# Altium project HPBIController.PrjPCB (part 7 of 8)

## Sheet QSPIFlash.SchDoc: 02290_Sonoma_Controller
size B; ApprovedBy: J Johnson; CheckedBy: J Johnson; Author: sdfasdfdfAEFfasdFfaF; DrawnBy: J Johnson; Organization: Opsero Electronic Design; Address1: 21-915 Av. Marguerite-Bourgeoys; Address2: Québec (QC); Address3: G1S 3X4; DocumentNumber: OP009-001-SCH; Revision: D-1; SheetNumber: 06; SheetTotal: 16; Tel1: (581) 308-8830; Tel2: (581) 308-8830; Project: 02290_Sonoma_Controller; CheckedDate: 2013-12-13; Sheet: QSPI Flash; PageSetup: Record=PageOptions|CenterHorizontal=True|CenterVertical=True|PrintScale=1.08|XCorrection=1.00|YCorrection=1.00|PrintKind=0|BorderSize=5000000|LeftOffset=0|BottomOffset=0|Orientation=2|PaperLength=1000|PaperWidth=1000|Scale=100|PaperSource=7|PrintQuality=-4|MediaType=1|DitherType=10|PaperKind=Tabloid     [11 x 17 in]|PrintScaleMode=1; DrawDate: 2013-12-13; SchTitle: 02290_Sonoma_Controller; RevDescription: Replaced Q2,Q3 with STD16NF06LT4; RevDate: 2020-07-07; RevBy: J Johnson; RevDescription2: Added resistors to QSPI interface; ModifiedDate: 2020-07-07
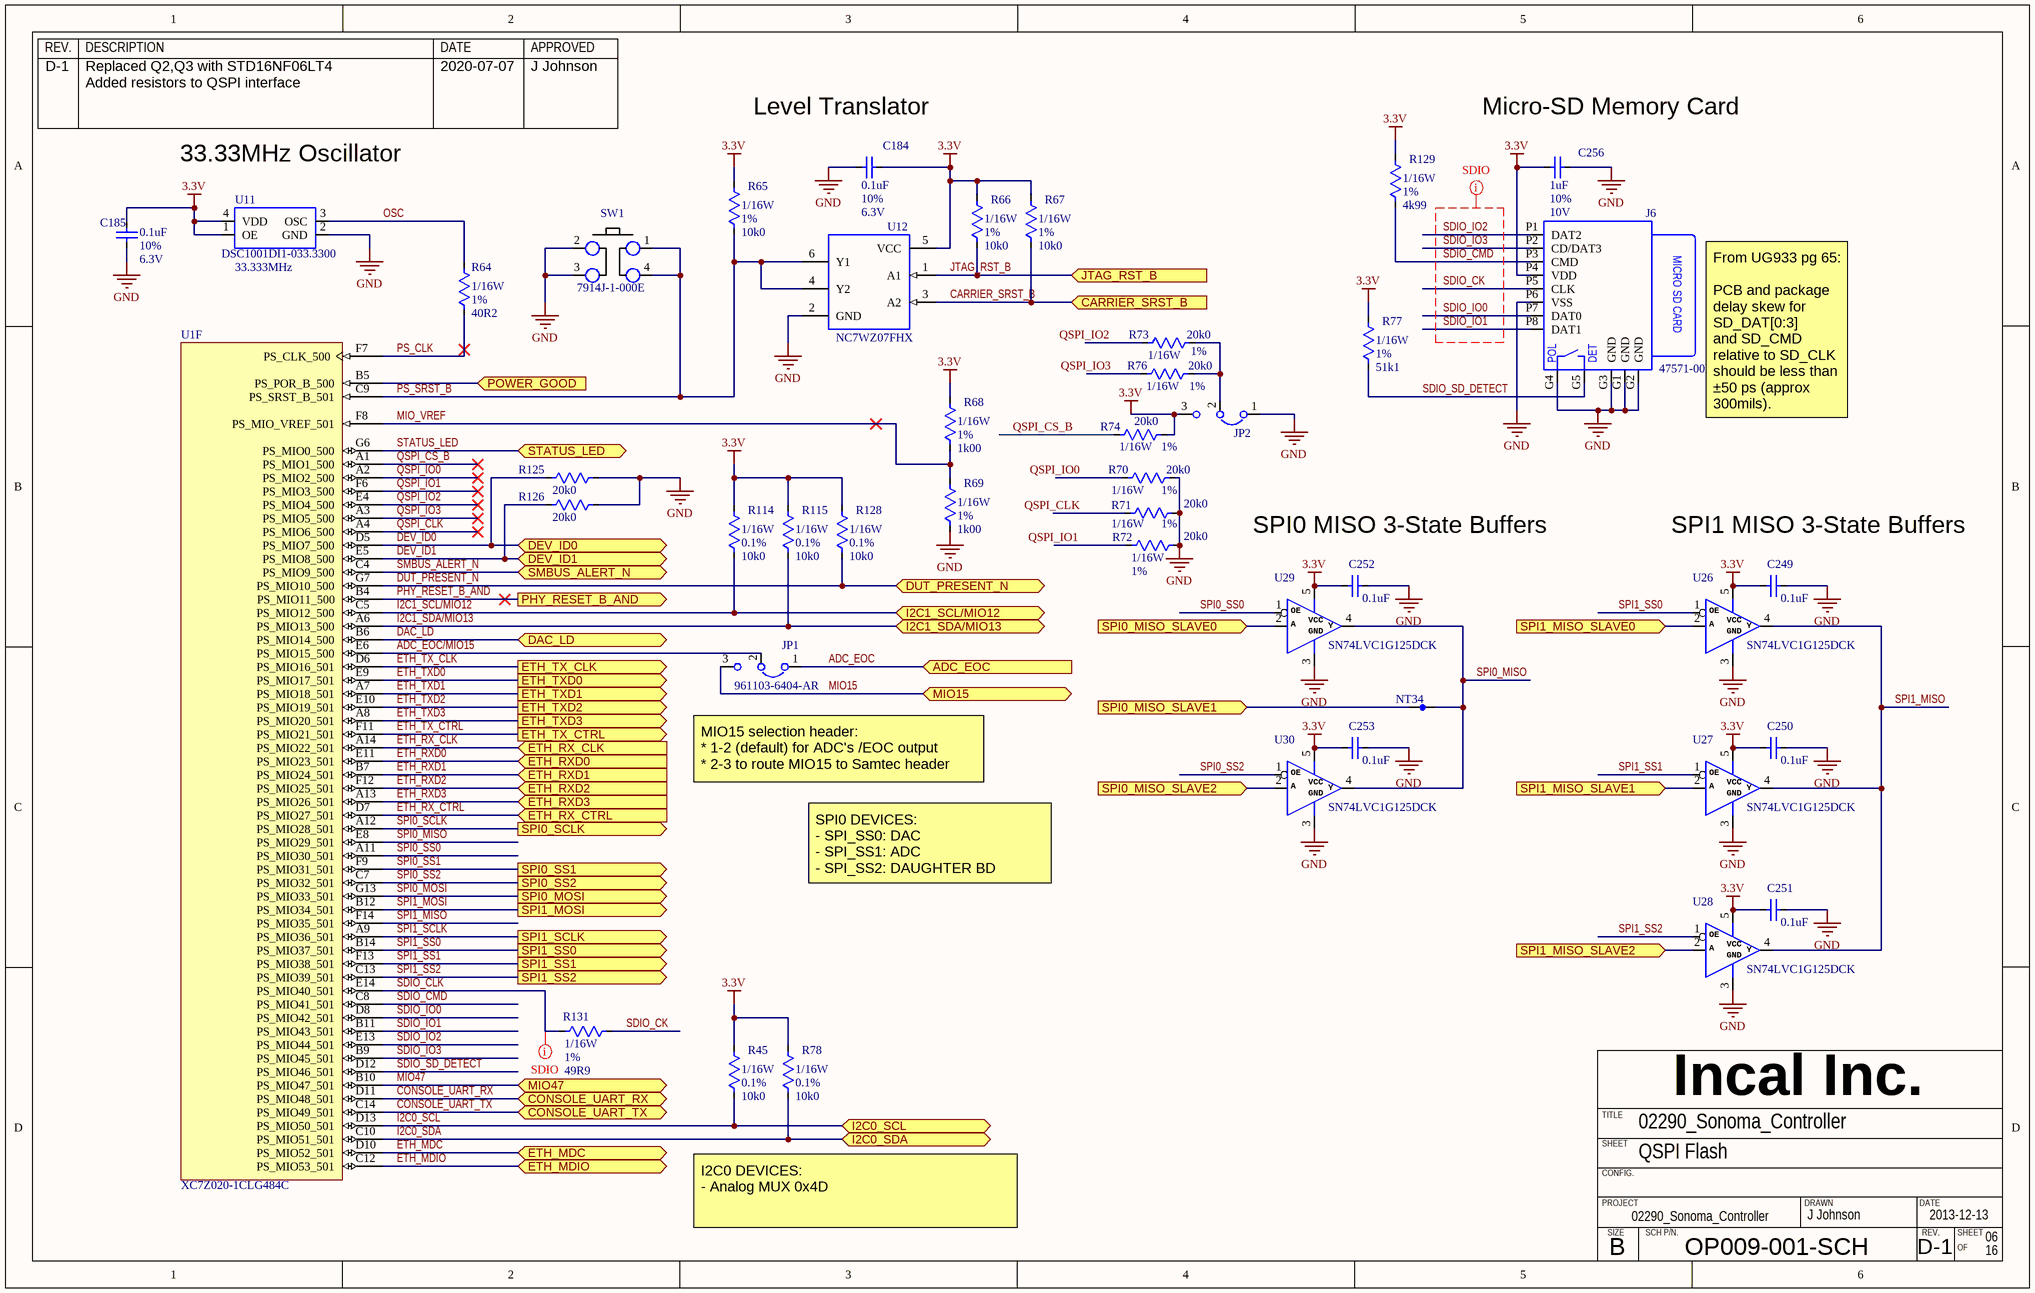
[diagram p13: QSPIFlash.SchDoc]

### Parts
C184  value 0.1uF  Tolerance: 10%  Voltage: 6.3V  [CAPC0603X33N]  (hidden comment: CAPACITOR_NP_TYPE1)
C185  value 0.1uF  Tolerance: 10%  Voltage: 6.3V  [CAPC0603X33N]  (hidden comment: CAPACITOR_NP_TYPE1)
C249  value 0.1uF  [CAPC0603X33N]  (hidden comment: CAPACITOR_NP_TYPE1)
C250  value 0.1uF  [CAPC0603X33N]  (hidden comment: CAPACITOR_NP_TYPE1)
C251  value 0.1uF  [CAPC0603X33N]  (hidden comment: CAPACITOR_NP_TYPE1)
C252  value 0.1uF  [CAPC0603X33N]  (hidden comment: CAPACITOR_NP_TYPE1)
C253  value 0.1uF  [CAPC0603X33N]  (hidden comment: CAPACITOR_NP_TYPE1)
C256  value 1uF  Tolerance: 10%  Voltage: 10V  [CAPC1005X33N]  (hidden comment: CAPACITOR_NP_TYPE1)
J6  SD_MICRO_DET1  [47571-0001]  (value not drawn)
JP1  Mfg Part Number 1: 961103-6404-AR  [JMPR3P254_SHUNT12]  (hidden comment: JP_HDR3x1_DEF1)
JP2  JP_HDR3x1_DEF1  [JMPR3P254_SHUNT12]  (value not drawn)
NT34  NET_TIE_1X1  [NET_TIE_1X1]  (value not drawn)  (net tie, no BOM)
R45  value 10k0  Power: 1/16W  Tolerance: 0.1%  [RESC1005X33N]  (hidden comment: *)
R64  value 40R2  Power: 1/16W  Tolerance: 1%  [RESC1005X33N]  (hidden comment: *)
R65  value 10k0  Power: 1/16W  Tolerance: 1%  [RESC1005X33N]  (hidden comment: *)
R66  value 10k0  Power: 1/16W  Tolerance: 1%  [RESC1005X33N]  (hidden comment: *)
R67  value 10k0  Power: 1/16W  Tolerance: 1%  [RESC1005X33N]  (hidden comment: *)
R68  value 1k00  Power: 1/16W  Tolerance: 1%  [RESC1005X33N]  (hidden comment: *)
R69  value 1k00  Power: 1/16W  Tolerance: 1%  [RESC1005X33N]  (hidden comment: *)
R70  value 20k0  Power: 1/16W  Tolerance: 1%  [RESC1005X33N]
R71  value 20k0  Power: 1/16W  Tolerance: 1%  [RESC1005X33N]
R72  value 20k0  Power: 1/16W  Tolerance: 1%  [RESC1005X33N]
R73  value 20k0  Power: 1/16W  Tolerance: 1%  [RESC1005X33N]
R74  value 20k0  Power: 1/16W  Tolerance: 1%  [RESC1005X33N]
R76  value 20k0  Power: 1/16W  Tolerance: 1%  [RESC1005X33N]
R77  value 51k1  Power: 1/16W  Tolerance: 1%  [RESC1005X33N]  (hidden comment: *)
R78  value 10k0  Power: 1/16W  Tolerance: 0.1%  [RESC1005X33N]  (hidden comment: *)
R114  value 10k0  Power: 1/16W  Tolerance: 0.1%  [RESC1005X33N]  (hidden comment: *)
R115  value 10k0  Power: 1/16W  Tolerance: 0.1%  [RESC1005X33N]  (hidden comment: *)
R125  value 20k0  [RESC1005X33N]  (hidden comment: *)
R126  value 20k0  [RESC1005X33N]  (hidden comment: *)
R128  value 10k0  Power: 1/16W  Tolerance: 0.1%  [RESC1005X33N]  (hidden comment: *)
R129  value 4k99  Power: 1/16W  Tolerance: 1%  [RESC1005X33N]  (hidden comment: *)
R131  value 49R9  Power: 1/16W  Tolerance: 1%  [RESC1005X33N]
SW1  value 7914J-1-000E  [7914J-1-000E]  (hidden comment: SW_SPST_TYPE1)
U1  XC7Z020-1CLG484C  [CLG484]  (part F of 10)
U11  value 33.333MHz  Mfg Part Number 1: DSC1001DI1-033.3300  [OSCSC165P200X250X85-4N]  (hidden comment: OSCILLATOR_TYPE1)
U12  NC7WZ07FHX  [DFN35P100X100X55-6N]
U26  value SN74LVC1G125DCK  [SOT65P210X110-5N]  (hidden comment: TINY_SCHM_BUF_TRIS_TYPE1)
U27  value SN74LVC1G125DCK  [SOT65P210X110-5N]  (hidden comment: TINY_SCHM_BUF_TRIS_TYPE1)
U28  value SN74LVC1G125DCK  [SOT65P210X110-5N]  (hidden comment: TINY_SCHM_BUF_TRIS_TYPE1)
U29  value SN74LVC1G125DCK  [SOT65P210X110-5N]  (hidden comment: TINY_SCHM_BUF_TRIS_TYPE1)
U30  value SN74LVC1G125DCK  [SOT65P210X110-5N]  (hidden comment: TINY_SCHM_BUF_TRIS_TYPE1)

### Ports
ADC_EOC (in), CARRIER_SRST_B (in), CONSOLE_UART_RX (bidir), CONSOLE_UART_TX (bidir), DAC_LD (bidir), DEV_ID0 (bidir), DEV_ID1 (bidir), DUT_PRESENT_N (bidir), ETH_MDC (bidir), ETH_MDIO (bidir), ETH_RX_CLK (in), ETH_RX_CTRL (in), ETH_RXD0 (in), ETH_RXD1 (in), ETH_RXD2 (in), ETH_RXD3 (in), ETH_TX_CLK (out), ETH_TX_CTRL (out), ETH_TXD0 (out), ETH_TXD1 (out), ETH_TXD2 (out), ETH_TXD3 (out), I2C0_SCL (bidir), I2C0_SDA (bidir), I2C1_SCL/MIO12 (bidir), I2C1_SDA/MIO13 (bidir), JTAG_RST_B (in), MIO15 (bidir), MIO47 (bidir), PHY_RESET_B_AND (out), POWER_GOOD (in), SMBUS_ALERT_N (bidir), SPI0_MISO_SLAVE0 (in), SPI0_MISO_SLAVE1 (in), SPI0_MISO_SLAVE2 (in), SPI0_MOSI (out), SPI0_SCLK (out), SPI0_SS1 (out), SPI0_SS2 (out), SPI1_MISO_SLAVE0 (in), SPI1_MISO_SLAVE1 (in), SPI1_MISO_SLAVE2 (in), SPI1_MOSI (out), SPI1_SCLK (out), SPI1_SS0 (out), SPI1_SS1 (out), SPI1_SS2 (out), STATUS_LED (bidir)

### Nets
3.3V: C184.1 C185.1 C249.1 C250.1 C251.1 C252.1 C253.1 C256.1 J6.P4(VDD) JP2.3 R45.1 R65.2 R66.2 R67.2 R68.1 R74.2 R77.1 R78.1 R114.1 R115.1 R128.1 R129.1 U11.1(OE) U11.4(VDD) U12.5(VCC) U26.5(VCC) U27.5(VCC) U28.5(VCC) U29.5(VCC) U30.5(VCC)
GND: C184.2 C185.2 C249.2 C250.2 C251.2 C252.2 C253.2 C256.2 J6.G1(GND) J6.G2(GND) J6.G3(GND) J6.G4(POL) J6.P6(VSS) JP2.1 R69.2 R70.2 R71.2 R72.2 R125.2 R126.2 SW1.2 SW1.3 U11.2(GND) U12.2(GND) U26.3(GND) U27.3(GND) U28.3(GND) U29.3(GND) U30.3(GND)
ADC_EOC: JP1.1 ; port ADC_EOC
ADC_EOC/MIO15: JP1.2 U1.E6(PS_MIO15_500)
CARRIER_SRST_B: R67.1 U12.3(A2) ; port CARRIER_SRST_B
CONSOLE_UART_RX: U1.D11(PS_MIO48_501) ; port CONSOLE_UART_RX
CONSOLE_UART_TX: U1.C14(PS_MIO49_501) ; port CONSOLE_UART_TX
DAC_LD: U1.B6(PS_MIO14_500) ; port DAC_LD
DEV_ID0: R125.1 U1.D5(PS_MIO7_500) ; port DEV_ID0
DEV_ID1: R126.1 U1.E5(PS_MIO8_500) ; port DEV_ID1
DUT_PRESENT_N: R128.2 U1.G7(PS_MIO10_500) ; port DUT_PRESENT_N
ETH_MDC: U1.D10(PS_MIO52_501) ; port ETH_MDC
ETH_MDIO: U1.C12(PS_MIO53_501) ; port ETH_MDIO
ETH_RX_CLK: U1.A14(PS_MIO22_501) ; port ETH_RX_CLK
ETH_RX_CTRL: U1.D7(PS_MIO27_501) ; port ETH_RX_CTRL
ETH_RXD0: U1.E11(PS_MIO23_501) ; port ETH_RXD0
ETH_RXD1: U1.B7(PS_MIO24_501) ; port ETH_RXD1
ETH_RXD2: U1.F12(PS_MIO25_501) ; port ETH_RXD2
ETH_RXD3: U1.A13(PS_MIO26_501) ; port ETH_RXD3
ETH_TX_CLK: U1.D6(PS_MIO16_501) ; port ETH_TX_CLK
ETH_TX_CTRL: U1.F11(PS_MIO21_501) ; port ETH_TX_CTRL
ETH_TXD0: U1.E9(PS_MIO17_501) ; port ETH_TXD0
ETH_TXD1: U1.A7(PS_MIO18_501) ; port ETH_TXD1
ETH_TXD2: U1.E10(PS_MIO19_501) ; port ETH_TXD2
ETH_TXD3: U1.A8(PS_MIO20_501) ; port ETH_TXD3
I2C0_SCL: R45.2 U1.D13(PS_MIO50_501) ; port I2C0_SCL
I2C0_SDA: R78.2 U1.C10(PS_MIO51_501) ; port I2C0_SDA
I2C1_SCL/MIO12: R114.2 U1.C5(PS_MIO12_500) ; port I2C1_SCL/MIO12
I2C1_SDA/MIO13: R115.2 U1.A6(PS_MIO13_500) ; port I2C1_SDA/MIO13
JTAG_RST_B: R66.1 U12.1(A1) ; port JTAG_RST_B
MIO15: JP1.3 ; port MIO15
MIO47: U1.B10(PS_MIO47_501) ; port MIO47
MIO_VREF: R68.2 R69.1 U1.F8(PS_MIO_VREF_501)
OSC: R64.1 U11.3(OSC)
PHY_RESET_B_AND: U1.B4(PS_MIO11_500) ; port PHY_RESET_B_AND
POWER_GOOD: U1.B5(PS_POR_B_500) ; port POWER_GOOD
PS_CLK: R64.2 U1.F7(PS_CLK_500)
PS_SRST_B: R65.1 SW1.1 SW1.4 U1.C9(PS_SRST_B_501) U12.4(Y2) U12.6(Y1)
QSPI_CLK: R71.1 U1.A4(PS_MIO6_500)
QSPI_CS_B: R74.1 U1.A1(PS_MIO1_500)
QSPI_IO0: R70.1 U1.A2(PS_MIO2_500)
QSPI_IO1: R72.1 U1.F6(PS_MIO3_500)
QSPI_IO2: R73.1 U1.E4(PS_MIO4_500)
QSPI_IO3: R76.1 U1.A3(PS_MIO5_500)
SDIO_CK: J6.P5(CLK) R131.2
SDIO_CLK: R131.1 U1.E14(PS_MIO40_501)
SDIO_CMD: J6.P3(CMD) R129.2 U1.C8(PS_MIO41_501)
SDIO_IO0: J6.P7(DAT0) U1.D8(PS_MIO42_501)
SDIO_IO1: J6.P8(DAT1) U1.B11(PS_MIO43_501)
SDIO_IO2: J6.P1(DAT2) U1.E13(PS_MIO44_501)
SDIO_IO3: J6.P2(CD/DAT3) U1.B9(PS_MIO45_501)
SDIO_SD_DETECT: J6.G5(DET) R77.2 U1.D12(PS_MIO46_501)
SMBUS_ALERT_N: U1.C4(PS_MIO9_500) ; port SMBUS_ALERT_N
SPI0_MISO: NT34.2 U1.E8(PS_MIO29_501) U29.4(Y) U30.4(Y)
SPI0_MISO_SLAVE0: U29.2(A) ; port SPI0_MISO_SLAVE0
SPI0_MISO_SLAVE1: NT34.1 ; port SPI0_MISO_SLAVE1
SPI0_MISO_SLAVE2: U30.2(A) ; port SPI0_MISO_SLAVE2
SPI0_MOSI: U1.G13(PS_MIO33_501) ; port SPI0_MOSI
SPI0_SCLK: U1.A12(PS_MIO28_501) ; port SPI0_SCLK
SPI0_SS0: U1.A11(PS_MIO30_501) U29.1(~{OE})
SPI0_SS1: U1.F9(PS_MIO31_501) ; port SPI0_SS1
SPI0_SS2: U1.C7(PS_MIO32_501) U30.1(~{OE}) ; port SPI0_SS2
SPI1_MISO: U1.F14(PS_MIO35_501) U26.4(Y) U27.4(Y) U28.4(Y)
SPI1_MISO_SLAVE0: U26.2(A) ; port SPI1_MISO_SLAVE0
SPI1_MISO_SLAVE1: U27.2(A) ; port SPI1_MISO_SLAVE1
SPI1_MISO_SLAVE2: U28.2(A) ; port SPI1_MISO_SLAVE2
SPI1_MOSI: U1.B12(PS_MIO34_501) ; port SPI1_MOSI
SPI1_SCLK: U1.A9(PS_MIO36_501) ; port SPI1_SCLK
SPI1_SS0: U1.B14(PS_MIO37_501) U26.1(~{OE}) ; port SPI1_SS0
SPI1_SS1: U1.F13(PS_MIO38_501) U27.1(~{OE}) ; port SPI1_SS1
SPI1_SS2: U1.C13(PS_MIO39_501) U28.1(~{OE}) ; port SPI1_SS2
STATUS_LED: U1.G6(PS_MIO0_500) ; port STATUS_LED
NetJP2_2: JP2.2 R73.2 R76.2

### Layout directives
net class SDIO: SDIO_CK, SDIO_CLK, SDIO_CMD, SDIO_IO0, SDIO_IO1, SDIO_IO2, SDIO_IO3

### Notes on the sheet
- 33.33MHz Oscillator
- Level Translator
- (near C256) Micro-SD Memory Card
- From UG933 pg 65:
  PCB and package delay skew for SD_DAT[0:3]
  and SD_CMD relative to SD_CLK should be less than ±50 ps (approx 300mils).
- SPI0 MISO 3-State Buffers
- SPI1 MISO 3-State Buffers
- (near JP1) MIO15 selection header:
  * 1-2 (default) for ADC's /EOC output
  * 2-3 to route MIO15 to Samtec header
- SPI0 DEVICES:
  - SPI_SS0: DAC
  - SPI_SS1: ADC
  - SPI_SS2: DAUGHTER BD
- I2C0 DEVICES:
  - Analog MUX 0x4D
- REV.
- DESCRIPTION
- DATE
- APPROVED
- Incal Inc.
- SHEET
- TITLE
- CONFIG.
- PROJECT
- SIZE
- SCH P/N.
- DRAWN
- B
- OF
- (in symbol 47571-0001) MICRO SD CARD
- (in symbol SN74LVC1G125DCK) OE

### Library data of the parts
C184 C185 C249-C253 = C0201_0.1uF_10%_6.3V_X5R: Capacitor ceramic, X5R, 0.1uF, 6.3V, 10%, -55 to +125 C, EIA0201; Manufacturer 1: Murata; Mfg Part Number 1: GRM033R60J104KE19D; EIA(I) Package: 0201; EIA(M) Package: 0603; ASSY: USED; Status: Active; Power: *; Current: *; Part Ref: C0201_0.1uF_10%_6.3V_X5R; Comment_1: *; RoHs: True; Operating Temp: -55 to +85 C
  C249-C253: Tolerance: 10%; Voltage: 6.3V
C256 = C0402_1uF_10%_10V_X5R: Capacitor ceramic, X5R, 1uF, 10V, 10%, -55 to +85 C, EIA0402; Manufacturer 1: Murata; Mfg Part Number 1: GRM155R61A105KE15J; EIA(I) Package: 0402; EIA(M) Package: 1005; ASSY: USED; Status: Active; Power: *; Current: *; Part Ref: C0402_1uF_10%_10V_X5R; Comment_1: *; RoHs: True; Operating Temp: -55 to +85 C
J6 = 47571-0001: MicroSD Card Header with Detect, 9 pin, RA, 1.10 mm, SMT, -40 to +85C; Manufacturer 1: Molex; ASSY: USED; Power: Pow; Current: Cur; Voltage: Vol; Comment_1: Com; Status: Active; EIA(I) Package: *; EIA(M) Package: *; Part Ref: 47571-0001; Tolerance: *; Package: *; RoHs: True; Value: 47571-0001; Operating Temp: -40 to +85C; Mfg Part Number 1: 47571-0001
JP1 = JP_HDR3x1_DEF1: Jumper Header .100'', 3-pin, Default position 1-2, TH; Manufacturer 1: 3M; ASSY: USED; Power: Pow; Current: Cur; Voltage: Vol; Value: 961103-6404-AR; Status: Active; EIA(I) Package: *; EIA(M) Package: *; Part Ref: JP_HDR3x1_DEF1; Tolerance: *; Package: *; RoHs: True; Datasheet 1: ..\datasheet\Connector\3M\961102-6404-AR
JP2 = JP_HDR3x1_DEF1: Jumper Header 100mil, 3-pin, Default position 1-2, TH; Manufacturer 1: 3M; Value: 961103-6404-AR; Status: Active; EIA(I) Package: *; EIA(M) Package: *; Part Ref: JP_HDR3x1_DEF1; Tolerance: *; Package: *; RoHs: True; Mfg Part Number 1: 961103-6404-AR; Datasheet 1: http://multimedia.3m.com/mws/mediawebserver?66666UuZjcFSLXTtNxTElX&VEVuQEcuZgVs6EVs6E666666--
NT34 = NET_TIE_1X1: Net Tie 1 to 1; ASSY: USED; Status: Active; Power: *; Current: *; EIA(I) Package: *; EIA(M) Package: *; Part Ref: NET_TIE_1X1; Comment_1: *; RoHs: True; Value: NET_TIE; Tolerance: *; Voltage: *
R45 R78 R114 R115 R128 = R0402_10k0_0.1%: Resistor, 10k0, 1/16W, 0.1%, -50 to +155 C, EIA0402; Manufacturer 1: Panasonic - ECG; Mfg Part Number 1: ERA-2AEB103X; EIA(I) Package: 0402; EIA(M) Package: 1005; Voltage: 50V; ASSY: USED; Status: Active; Part Ref: R0402_10k0_0.1%; Current: *; Comment_1: *; RoHs: True; Package: 0402; Operating Temp: -50 to +155 C; Datasheet 1: ..\datasheet\Resistor\Panasonic ECG\ERA\2012-10-25; Manufacturer 2: Vishay Dale; Mfg Part Number 2: TNPW040210K0BEED; Datasheet 2: ..\datasheet\Resistor\Vishay Dale\TNPW\2012-03-29
R64 = R0402_40R2_1%: Resistor, 40R2, 1/16W, 1%, -50 to +155 C, EIA0402, EIA(M)1005; Manufacturer 1: Yageo; Mfg Part Number 1: RC0402FR-0740R2L; EIA(I) Package: 0402; EIA(M) Package: 1005; Voltage: 50V; ASSY: USED; Status: Active; Part Ref: R0402_40R2_1%; Current: *; Comment_1: *; RoHs: True; Operating Temp: -50 to +155 C; Datasheet 1: ..\datasheet\Resistor\Yaego\Thick_Film\RC0402\2012-03-29; Manufacturer 2: Vishay Dale; Mfg Part Number 2: CRCW040240R2FKED; Datasheet 2: ..\datasheet\Resistor\Vishay Dale\CRC\2012-03-29
R65-R67 = R0402_10k0_1%: Resistor, 10k0, 1/16W, 1%, -55 to +155 C, EIA0402; Manufacturer 1: Yageo; Mfg Part Number 1: RC0402FR-0710k0L; EIA(I) Package: 0402; EIA(M) Package: 1005; Voltage: 50V; ASSY: USED; Status: Active; Part Ref: R0402_10k0_1%; Current: *; Comment_1: *; RoHs: True; Package: 0402; Operating Temp: -55 to +155 C; Datasheet 1: ..\datasheet\Resistor\Yaego\Thick_Film\RC0402\2012-03-29; Manufacturer 2: Vishay Dale; Mfg Part Number 2: CRCW040210k0FKED; Datasheet 2: ..\datasheet\Resistor\Vishay Dale\CRC\2012-03-29
R68 R69 = R0402_1k00_1%: Resistor, 1k00, 1/16W, 1%, -55 to +155 C, EIA0402; Manufacturer 1: Yageo; Mfg Part Number 1: RC0402FR-071K00L; EIA(I) Package: 0402; EIA(M) Package: 1005; Voltage: 50V; ASSY: USED; Status: Active; Part Ref: R0402_1k00_1%; Current: *; Comment_1: *; RoHs: True; Operating Temp: -55 to +155 C; Datasheet 1: ..\datasheet\Resistor\Yaego\Thick_Film\RC0402\2012-03-29; Manufacturer 2: Vishay Dale; Mfg Part Number 2: CRCW04021k00FKED; Datasheet 2: ..\datasheet\Resistor\Vishay Dale\CRC\2012-03-29
R70-R74 R76 = R0402_20k0_1%: Resistor, 20k0, 1%, 1/16W, 0402; Manufacturer 1: Vishay Dale; Mfg Part Number 1: CRCW040220k0FKED; EIA(I) Package: 0402; EIA(M) Package: 1005; Voltage: 50V; Status: Active; Part Ref: R0402_20k0_1%; Current: *; RoHs: True; Operating Temp: -50 to +155 C; Datasheet 1: http://www.vishay.com/docs/49378/49378_sg2020.pdf
R77 = R0402_51k1_1%: Resistor, 51k1, 1/16W, 1%, -50 to +155 C, EIA0402, EIA(M)1005; Manufacturer 1: Yageo; Mfg Part Number 1: RC0402FR-0751k1L; EIA(I) Package: 0402; EIA(M) Package: 1005; Voltage: 50V; ASSY: USED; Status: Active; Part Ref: R0402_51k1_1%; Current: *; Comment_1: *; RoHs: True; Operating Temp: -50 to +155 C; Datasheet 1: ..\datasheet\Resistor\Yaego\Thick_Film\RC0402\2012-03-29; Manufacturer 2: Vishay Dale; Mfg Part Number 2: CRCW040251k1FKED; Datasheet 2: ..\datasheet\Resistor\Vishay Dale\CRC\2012-03-29
R125 R126 = R0402_20k0_1%: Resistor, 20k0, 1/16W, 1%, -50 to +155 C, EIA0402, EIA(M)1005; Manufacturer 1: Yageo; Mfg Part Number 1: RC0402FR-0720k0L; EIA(I) Package: 0402; EIA(M) Package: 1005; Voltage: 50V; ASSY: USED; Status: Active; Part Ref: R0402_20k0_1%; Current: *; Comment_1: *; RoHs: True; Power: 1/16W; Tolerance: 1%; Operating Temp: -50 to +155 C; Datasheet 1: ..\datasheet\Resistor\Yaego\Thick_Film\RC0402\2012-03-29; Manufacturer 2: Vishay Dale; Mfg Part Number 2: CRCW040220k0FKED; Datasheet 2: ..\datasheet\Resistor\Vishay Dale\CRC\2012-03-29
R129 = R0402_4k99_1%: Resistor, 4k99, 1/16W, 1%, -50 to +155 C, EIA0402, EIA(M)1005; Manufacturer 1: Yageo; Mfg Part Number 1: RC0402FR-074k99L; EIA(I) Package: 0402; EIA(M) Package: 1005; Voltage: 50V; ASSY: USED; Status: Active; Part Ref: R0402_4k99_1%; Current: *; Comment_1: *; RoHs: True; Operating Temp: -50 to +155 C; Datasheet 1: ..\datasheet\Resistor\Yaego\Thick_Film\RC0402\2012-03-29; Manufacturer 2: Vishay Dale; Mfg Part Number 2: CRCW04024k99FKED; Datasheet 2: ..\datasheet\Resistor\Vishay Dale\CRC\2012-03-29
R131 = R0402_49R9_1%: Resistor, 49R9, 1%, 1/16W, 0402, 0402; Manufacturer 1: Yageo; Mfg Part Number 1: RC0402FR-0749R9L; EIA(I) Package: 0402; EIA(M) Package: 1005; Voltage: 50V; Status: Active; Part Ref: R0402_49R9_1%; Current: *; RoHs: True; Package: 0402; Operating Temp: -55 to +155 C; Datasheet 1: http://www.yageo.com/exep/pages/download/literatures/PYu-R_Marking_2.pdf; Manufacturer 2: Vishay Dale; Mfg Part Number 2: CRCW040249R9FKED
SW1 = 7914J-1-000E: Switch, tactile, 39V, 4mm, -55 to +125 C, SMD; Manufacturer 1: Bourns; ASSY: USED; Power: Pow; Current: 100mA; Comment_1: Com; Status: Active; EIA(I) Package: *; EIA(M) Package: *; Part Ref: 7914J-1-000E; Tolerance: *; Voltage: 39V; Package: *; RoHs: True; Operating Temp: -55 to +125 C; Mfg Part Number 1: 7914J-1-000E
U1 = XC7Z020-1CLG484C: 667 MHz Zynq™-7000 AP SoC, 130 PS I/O, 200 FPGA I/O, 484-Ball BGA, Speed Grade 1, Commercial Grade; Manufacturer: Xilinx; Extensible Block RAM (# 36Kb Blocks): 560 KB (140); Flip Flops: 106400; LUTs: 53200; Speed Grade: -1; DatasheetVersion: v1.2; PackageVersion: Rev 1.1; PackageReference: CLG484; PackageDescription: Wire-Bond Chip-Scale BGA, Body 19 x 19 mm, 0.8 mm Pitch; Generic Part Number: XC7Z020; RoHS: True; Mounting Technology: Surface Mount; Code_JEDEC: MO-275-PPAA-2; PartNumber: XC7Z020-1CLG484C; ComponentLink1Description: Datasheet; ComponentLink1URL: http://www.xilinx.com/support/documentation/data_sheets/ds190-Zynq-7000-Overview.pdf; ComponentLink2Description: Package Specification; ComponentLink2URL: http://www.xilinx.com/support/documentation/user_guides/ug865-Zynq-7000-Pkg-Pinout.pdf; ComponentLink3Description: DC and AC Switching Characteristics; ComponentLink3URL: http://www.xilinx.com/support/documentation/data_sheets/ds187-XC7Z010-XC7Z020-Data-Sheet.pdf; ComponentLink4Description: Package File; ComponentLink4URL: http://www.xilinx.com/support/packagefiles/z7packages/xc7z020clg484pkg.txt; ComponentLink5Description: Packaging and Pinout; ComponentLink5URL: http://www.xilinx.com/support/documentation/user_guides/ug865-Zynq-7000-Pkg-Pinout.pdf; ComponentLink6Description: PCB and Layout Guide; ComponentLink6URL: http://www.xilinx.com/support/documentation/user_guides/ug483_7Series_PCB.pdf; Part Ref: XC7Z020-1CLG484C; Status: Active; Value: XC7Z020-1CLG484C; Manufacturer 1: Xilinx; Mfg Part Number 1: XC7Z020-1CLG484C; Package: CLG484
U11 = DSC1001DI1-033.3300: Oscillator, CMOS, 33.333MHz, 50ppm, 1.7V to 3.6V, -40 to +85C, SMT; Manufacturer 1: Discera; ASSY: USED; Status: Active; Power: *; EIA(I) Package: *; EIA(M) Package: *; Part Ref: DSC1001DI1-033.3300; Voltage: 1.7V to 3.6V; Comment_1: *; Current: *; RoHs: True; Tolerance: *; Operating Temp: -40 to +85 C
U12 = NC7WZ07FHX: UHS Dual Buffer, Tiny Logic, 1.65 to 5.5V, -40 to +85 C, 200mW, MicroPak2-6; Manufacturer 1: Fairchild Semiconductor; ASSY: USED; Power: Pow; Current: + - 24mA; Status: Active; EIA(I) Package: *; EIA(M) Package: *; Part Ref: NC7WZ07FHX; Tolerance: *; Voltage: 1.65 to 5.5V; Package: SOT-23-5; RoHs: True; Value: NC7WZ07FHX; Operating Temp: -40 to +85 C; Mfg Part Number 1: NC7WZ07FHX
U26-U30 = SN74LVC1G125DCK: Tristate buffer, 1.65 to 5.5V, +/- 24mA, -40 to +125 C, 150mW, SC70; Manufacturer 1: Texas Instrument; ASSY: USED; Current: + - 24mA; Comment_1: Com; Status: Active; EIA(I) Package: *; EIA(M) Package: *; Part Ref: SN74LVC1G125DCK; Power: 150mW; Tolerance: *; Voltage: 1.65 to 5.5V; Package: SC70; RoHs: True; Mfg Part Number 1: SN74LVC1G125DCK; Datasheet 1: ..\datasheet\Logic\TI\SN74LVC1G125DCK\2013-08-14

## Sheet Power.SchDoc: 02290_Sonoma_Controller
size B; ApprovedBy: J Johnson; CheckedBy: J Johnson; Author: sdfasdfdfAEFfasdFfaF; DrawnBy: J Johnson; Organization: Opsero Electronic Design; Address1: 21-915 Av. Marguerite-Bourgeoys; Address2: Québec (QC); Address3: G1S 3X4; DocumentNumber: OP009-001-SCH; Revision: D-1; SheetNumber: 13; SheetTotal: 16; Tel1: (581) 308-8830; Tel2: (581) 308-8830; Project: 02290_Sonoma_Controller; CheckedDate: 2013-12-13; Sheet: Power Supplies; PageSetup: Record=PageOptions|CenterHorizontal=True|CenterVertical=True|PrintScale=1.08|XCorrection=1.00|YCorrection=1.00|PrintKind=0|BorderSize=5000000|LeftOffset=0|BottomOffset=0|Orientation=2|PaperLength=1000|PaperWidth=1000|Scale=100|PaperSource=7|PrintQuality=-4|MediaType=1|DitherType=10|PaperKind=Tabloid     [11 x 17 in]|PrintScaleMode=1; DrawDate: 2013-12-13; SchTitle: 02290_Sonoma_Controller; RevDescription: Replaced Q2,Q3 with STD16NF06LT4; RevDate: 2020-07-07; RevBy: J Johnson; RevDescription2: Added resistors to QSPI interface; ModifiedDate: 2020-07-07
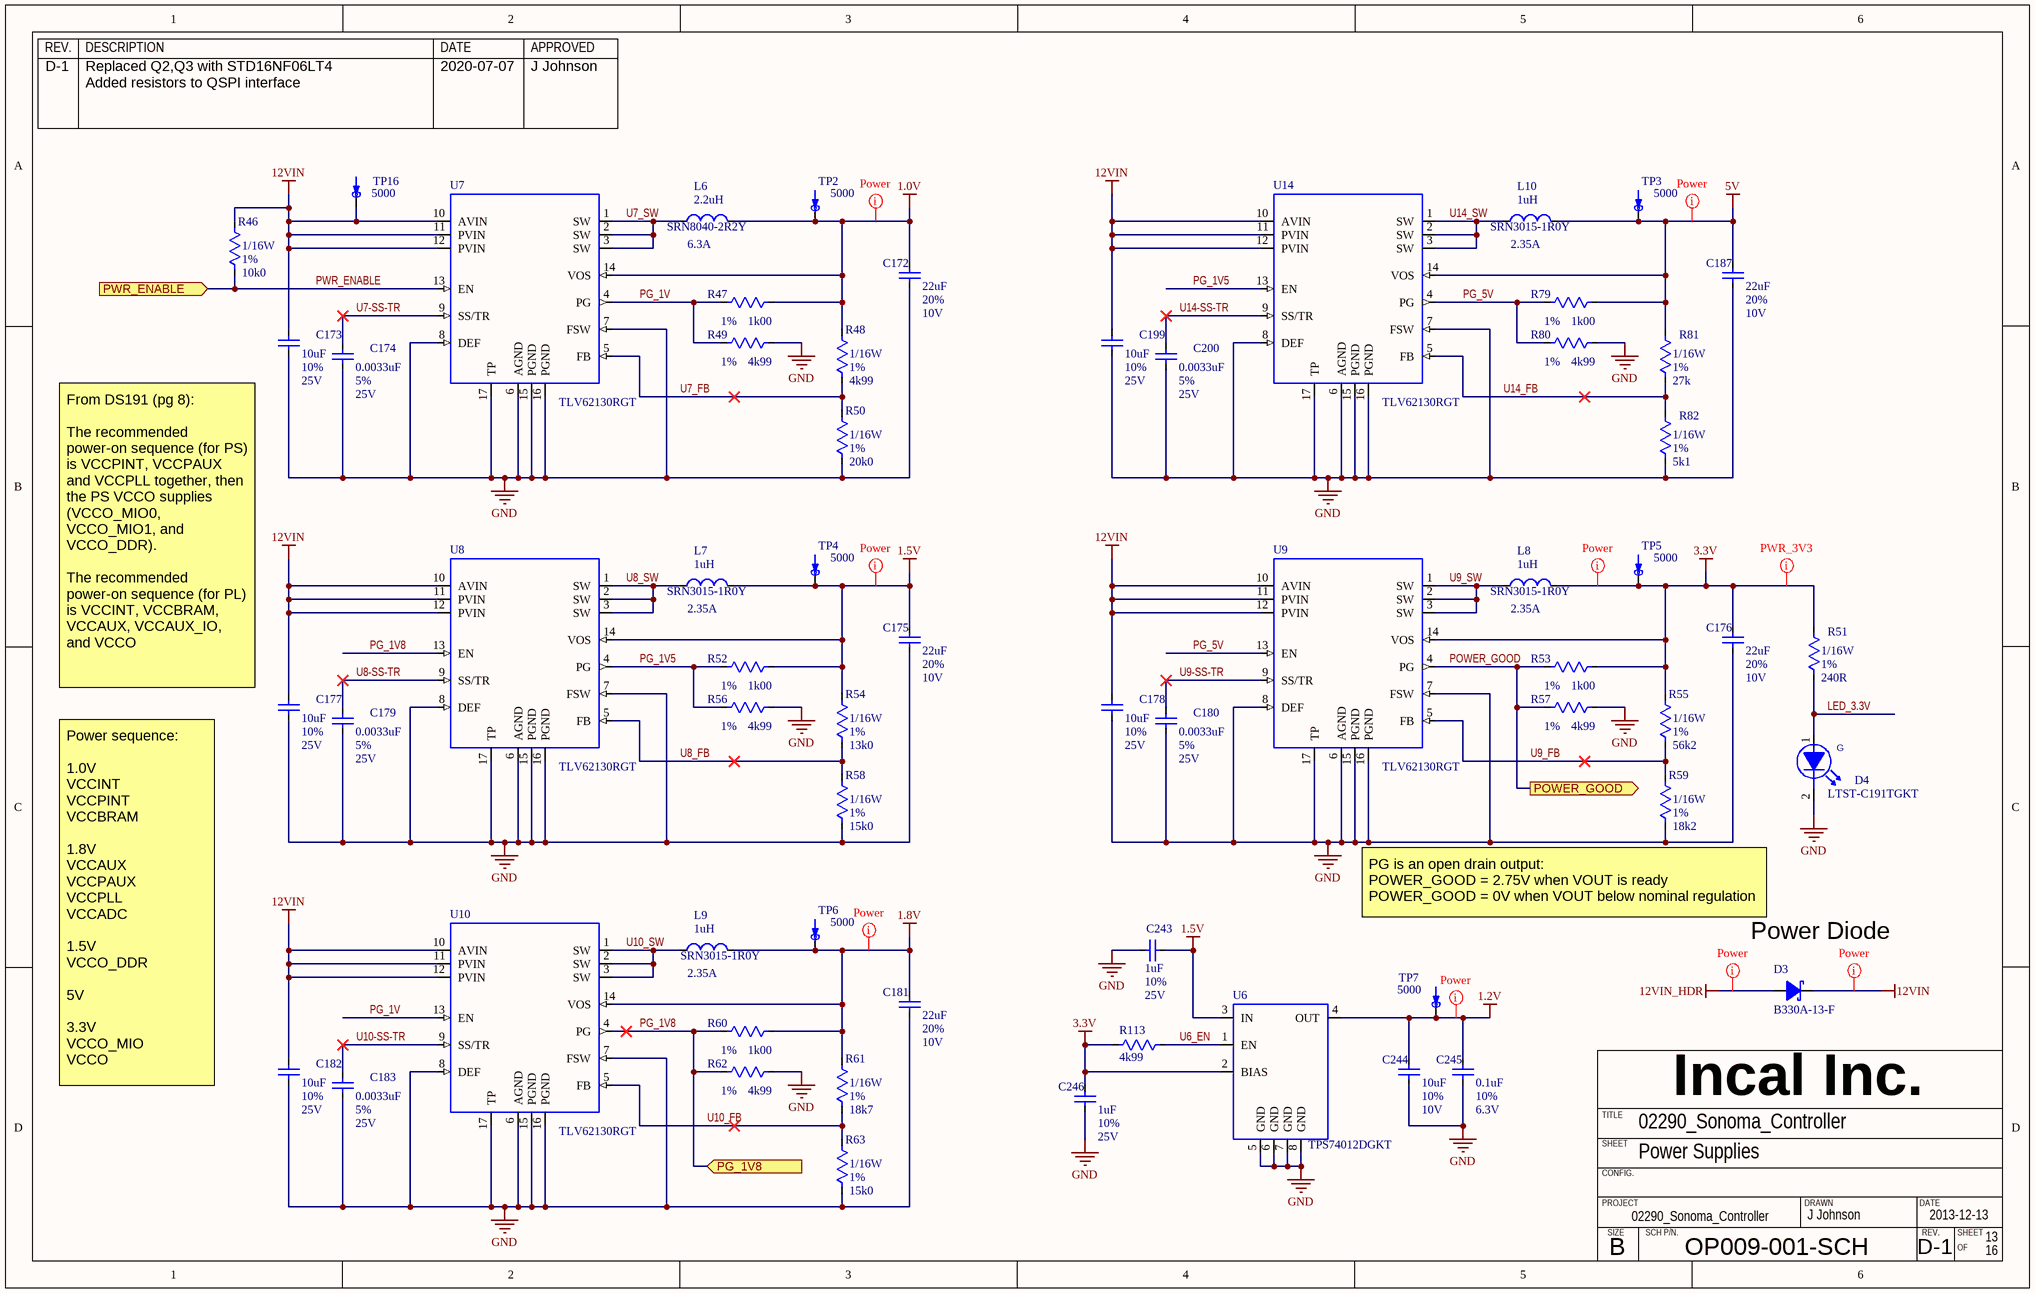
[diagram p14: Power.SchDoc]

### Parts
C172  value 22uF  Tolerance: 20%  Voltage: 10V  [CAPC2013X125N]  (hidden comment: CAPACITOR_NP_TYPE1)
C173  value 10uF  Tolerance: 10%  Voltage: 25V  [CAPC3216X127N]  (hidden comment: CAPACITOR_NP_TYPE1)
C174  value 0.0033uF  Tolerance: 5%  Voltage: 25V  [CAPC1005X55N]  (hidden comment: CAPACITOR_NP_TYPE1)
C175  value 22uF  Tolerance: 20%  Voltage: 10V  [CAPC2013X125N]  (hidden comment: CAPACITOR_NP_TYPE1)
C176  value 22uF  Tolerance: 20%  Voltage: 10V  [CAPC2013X125N]  (hidden comment: CAPACITOR_NP_TYPE1)
C177  value 10uF  Tolerance: 10%  Voltage: 25V  [CAPC3216X127N]  (hidden comment: CAPACITOR_NP_TYPE1)
C178  value 10uF  Tolerance: 10%  Voltage: 25V  [CAPC3216X127N]  (hidden comment: CAPACITOR_NP_TYPE1)
C179  value 0.0033uF  Tolerance: 5%  Voltage: 25V  [CAPC1005X55N]  (hidden comment: CAPACITOR_NP_TYPE1)
C180  value 0.0033uF  Tolerance: 5%  Voltage: 25V  [CAPC1005X55N]  (hidden comment: CAPACITOR_NP_TYPE1)
C181  value 22uF  Tolerance: 20%  Voltage: 10V  [CAPC2013X125N]  (hidden comment: CAPACITOR_NP_TYPE1)
C182  value 10uF  Tolerance: 10%  Voltage: 25V  [CAPC3216X127N]  (hidden comment: CAPACITOR_NP_TYPE1)
C183  value 0.0033uF  Tolerance: 5%  Voltage: 25V  [CAPC1005X55N]  (hidden comment: CAPACITOR_NP_TYPE1)
C187  value 22uF  Tolerance: 20%  Voltage: 10V  [CAPC2013X125N]  (hidden comment: CAPACITOR_NP_TYPE1)
C199  value 10uF  Tolerance: 10%  Voltage: 25V  [CAPC3216X127N]  (hidden comment: CAPACITOR_NP_TYPE1)
C200  value 0.0033uF  Tolerance: 5%  Voltage: 25V  [CAPC1005X55N]  (hidden comment: CAPACITOR_NP_TYPE1)
C243  value 1uF  Tolerance: 10%  Voltage: 25V  [CAPC1608X38N]  (hidden comment: CAPACITOR_NP_TYPE1)
C244  value 10uF  Tolerance: 10%  Voltage: 10V  [CAPC1608X38N]  (hidden comment: CAPACITOR_NP_TYPE1)
C245  value 0.1uF  Tolerance: 10%  Voltage: 6.3V  [CAPC0603X33N]  (hidden comment: CAPACITOR_NP_TYPE1)
C246  value 1uF  Tolerance: 10%  Voltage: 25V  [CAPC1608X38N]  (hidden comment: CAPACITOR_NP_TYPE1)
D3  Mfg Part Number 1: B330A-13-F  [DIOM4629X230N]  (hidden comment: DIODE_SCHOTTKY_TYPE1)
D4  Mfg Part Number 1: LTST-C191TGKT  [LEDM1608X38N-GRN]  (hidden comment: LED_GRN)
L6  value 2.2uH  Current: 6.3A  Mfg Part Number 1: SRN8040-2R2Y  [INDM800800X400N]  (hidden comment: INDUCTOR_TYPE1)
L7  value 1uH  Current: 2.35A  Mfg Part Number 1: SRN3015-1R0Y  [INDM300300X150N]  (hidden comment: INDUCTOR_TYPE1)
L8  value 1uH  Current: 2.35A  Mfg Part Number 1: SRN3015-1R0Y  [INDM300300X150N]  (hidden comment: INDUCTOR_TYPE1)
L9  value 1uH  Current: 2.35A  Mfg Part Number 1: SRN3015-1R0Y  [INDM300300X150N]  (hidden comment: INDUCTOR_TYPE1)
L10  value 1uH  Current: 2.35A  Mfg Part Number 1: SRN3015-1R0Y  [INDM300300X150N]  (hidden comment: INDUCTOR_TYPE1)
R46  value 10k0  Power: 1/16W  Tolerance: 1%  [RESC1005X33N]  (hidden comment: *)
R47  value 1k00  Tolerance: 1%  [RESC1005X33N]  (hidden comment: *)
R48  value 4k99  Power: 1/16W  Tolerance: 1%  [RESC1005X33N]  (hidden comment: *)
R49  value 4k99  Tolerance: 1%  [RESC1005X33N]  (hidden comment: *)
R50  value 20k0  Power: 1/16W  Tolerance: 1%  [RESC1005X33N]  (hidden comment: *)
R51  value 240R  Power: 1/16W  Tolerance: 1%  [RESC1005X33N]  (hidden comment: *)
R52  value 1k00  Tolerance: 1%  [RESC1005X33N]  (hidden comment: *)
R53  value 1k00  Tolerance: 1%  [RESC1005X33N]  (hidden comment: *)
R54  value 13k0  Power: 1/16W  Tolerance: 1%  [RESC1005X33N]  (hidden comment: *)
R55  value 56k2  Power: 1/16W  Tolerance: 1%  [RESC1005X33N]  (hidden comment: *)
R56  value 4k99  Tolerance: 1%  [RESC1005X33N]  (hidden comment: *)
R57  value 4k99  Tolerance: 1%  [RESC1005X33N]  (hidden comment: *)
R58  value 15k0  Power: 1/16W  Tolerance: 1%  [RESC1005X33N]  (hidden comment: *)
R59  value 18k2  Power: 1/16W  Tolerance: 1%  [RESC1005X33N]  (hidden comment: *)
R60  value 1k00  Tolerance: 1%  [RESC1005X33N]  (hidden comment: *)
R61  value 18k7  Power: 1/16W  Tolerance: 1%  [RESC1005X33N]  (hidden comment: *)
R62  value 4k99  Tolerance: 1%  [RESC1005X33N]  (hidden comment: *)
R63  value 15k0  Power: 1/16W  Tolerance: 1%  [RESC1005X33N]  (hidden comment: *)
R79  value 1k00  Tolerance: 1%  [RESC1005X33N]  (hidden comment: *)
R80  value 4k99  Tolerance: 1%  [RESC1005X33N]  (hidden comment: *)
R81  value 27k  Power: 1/16W  Tolerance: 1%  [RESC1005X33N]  (hidden comment: *)
R82  value 5k1  Power: 1/16W  Tolerance: 1%  [RESC1005X33N]  (hidden comment: *)
R113  value 4k99  [RESC1005X33N]  (hidden comment: *)
TP2  value 5000  [KEY_5000]  (hidden comment: TEST_POINT_TYPE4)
TP3  value 5000  [KEY_5000]  (hidden comment: TEST_POINT_TYPE4)
TP4  value 5000  [KEY_5000]  (hidden comment: TEST_POINT_TYPE4)
TP5  value 5000  [KEY_5000]  (hidden comment: TEST_POINT_TYPE4)
TP6  value 5000  [KEY_5000]  (hidden comment: TEST_POINT_TYPE4)
TP7  value 5000  [KEY_5000]  (hidden comment: TEST_POINT_TYPE4)
TP16  value 5000  [KEY_5000]  (hidden comment: TEST_POINT_TYPE4)
U6  Mfg Part Number 1: TPS74012DGKT  [SOP65P490X110-8N]  (hidden comment: TPS740XXDGK)
U7  TLV62130RGT  [QFN50P300X300X100-17N]
U8  TLV62130RGT  [QFN50P300X300X100-17N]
U9  TLV62130RGT  [QFN50P300X300X100-17N]
U10  TLV62130RGT  [QFN50P300X300X100-17N]
U14  TLV62130RGT  [QFN50P300X300X100-17N]

### Ports
PG_1V8 (in), POWER_GOOD (out), PWR_ENABLE (in)

### Nets
1.0V: C172.1 L6.2 R47.2 R48.2 TP2.1 U7.14(VOS)
1.2V: C244.1 C245.1 TP7.1 U6.4(OUT)
1.5V: C175.1 C243.1 L7.2 R52.2 R54.2 TP4.1 U6.3(IN) U8.14(VOS)
1.8V: C181.1 L9.2 R60.2 R61.2 TP6.1 U10.14(VOS)
3.3V: C176.1 C246.1 L8.2 R51.1 R53.2 R55.2 R113.2 TP5.1 U6.2(BIAS) U9.14(VOS)
5V: C187.1 L10.2 R79.2 R81.2 TP3.1 U14.14(VOS)
12VIN: C173.1 C177.1 C178.1 C182.1 C199.1 D3.2(K) R46.2 TP16.1 U7.10(AVIN) U7.11(PVIN) U7.12(PVIN) U8.10(AVIN) U8.11(PVIN) U8.12(PVIN) U9.10(AVIN) U9.11(PVIN) U9.12(PVIN) U10.10(AVIN) U10.11(PVIN) U10.12(PVIN) U14.10(AVIN) U14.11(PVIN) U14.12(PVIN)
12VIN_HDR: D3.1(A)
GND: C172.2 C173.2 C174.2 C175.2 C176.2 C177.2 C178.2 C179.2 C180.2 C181.2 C182.2 C183.2 C187.2 C199.2 C200.2 C243.2 C244.2 C245.2 C246.2 D4.2(K) R49.2 R50.1 R56.2 R57.2 R58.1 R59.1 R62.2 R63.1 R80.2 R82.1 U6.5(GND) U6.6(GND) U6.7(GND) U6.8(GND) U7.6(AGND) U7.7(FSW) U7.8(DEF) U7.15(PGND) U7.16(PGND) U7.17(TP) U8.6(AGND) U8.7(FSW) U8.8(DEF) U8.15(PGND) U8.16(PGND) U8.17(TP) U9.6(AGND) U9.7(FSW) U9.8(DEF) U9.15(PGND) U9.16(PGND) U9.17(TP) U10.6(AGND) U10.7(FSW) U10.8(DEF) U10.15(PGND) U10.16(PGND) U10.17(TP) U14.6(AGND) U14.7(FSW) U14.8(DEF) U14.15(PGND) U14.16(PGND) U14.17(TP)
LED_3.3V: D4.1(A) R51.2
PG_1V: R47.1 R49.1 U7.4(PG) U10.13(EN)
PG_1V5: R52.1 R56.1 U8.4(PG) U14.13(EN)
PG_1V8: R60.1 R62.1 U8.13(EN) U10.4(PG) ; port PG_1V8
PG_5V: R79.1 R80.1 U9.13(EN) U14.4(PG)
POWER_GOOD: R53.1 R57.1 U9.4(PG) ; port POWER_GOOD
PWR_ENABLE: R46.1 U7.13(EN) ; port PWR_ENABLE
U6_EN: R113.1 U6.1(EN)
U7-SS-TR: C174.1 U7.9(SS/TR)
U7_FB: R48.1 R50.2 U7.5(FB)
U7_SW: L6.1 U7.1(SW) U7.2(SW) U7.3(SW)
U8-SS-TR: C179.1 U8.9(SS/TR)
U8_FB: R54.1 R58.2 U8.5(FB)
U8_SW: L7.1 U8.1(SW) U8.2(SW) U8.3(SW)
U9-SS-TR: C180.1 U9.9(SS/TR)
U9_FB: R55.1 R59.2 U9.5(FB)
U9_SW: L8.1 U9.1(SW) U9.2(SW) U9.3(SW)
U10-SS-TR: C183.1 U10.9(SS/TR)
U10_FB: R61.1 R63.2 U10.5(FB)
U10_SW: L9.1 U10.1(SW) U10.2(SW) U10.3(SW)
U14-SS-TR: C200.1 U14.9(SS/TR)
U14_FB: R81.1 R82.2 U14.5(FB)
U14_SW: L10.1 U14.1(SW) U14.2(SW) U14.3(SW)

### Layout directives
net class Power_3V3: 3.3V
net class Power: 1.0V, 1.2V, 1.5V, 1.8V, 3.3V, 5V, 12VIN, 12VIN_HDR

### Notes on the sheet
- From DS191 (pg 8):
  The recommended power-on sequence (for PS) is VCCPINT, VCCPAUX and VCCPLL together, then the PS VCCO supplies (VCCO_MIO0, VCCO_MIO1, and VCCO_DDR).
  The recommended power-on sequence (for PL) is VCCINT, VCCBRAM, VCCAUX, VCCAUX_IO, and VCCO
- (near R59) PG is an open drain output:
  POWER_GOOD = 2.75V when VOUT is ready
  POWER_GOOD = 0V when VOUT below nominal regulation
- (near D3) Power Diode
- Power sequence:
  1.0V
  VCCINT
  VCCPINT
  VCCBRAM
  1.8V
  VCCAUX
  VCCPAUX
  VCCPLL
  VCCADC
  1.5V
  VCCO_DDR
  5V
  3.3V
  VCCO_MIO
  VCCO
- REV.
- DESCRIPTION
- DATE
- APPROVED
- Incal Inc.
- SHEET
- TITLE
- CONFIG.
- PROJECT
- SIZE
- SCH P/N.
- DRAWN
- B
- OF
- (in symbol LTST-C191TGKT) G

### Library data of the parts
C172 C175 C176 C181 C187 = C0805_22uF_20%_10V_X5R: Capacitor ceramic, X5R, 22uF, 10V, 20%, -55 to +85 C, EIA0805; Manufacturer 1: Taiyo; Mfg Part Number 1: LMK212BJ226MG-T; EIA(I) Package: 0805; EIA(M) Package: 2012; ASSY: USED; Status: Active; Power: *; Current: *; Part Ref: C0805_22uF_20%_10V_X5R; Comment_1: *; RoHs: True; Operating Temp: -55 to +85 C
C173 C177 C178 C182 C199 = C1206_10uF_10%_25V_X5R: Capacitor ceramic, X5R, 10uF, 25V, 10%, -55 to +125 C, EIA1206; Manufacturer 1: AVX; Mfg Part Number 1: 12063D106KAT2A; EIA(I) Package: 1206; EIA(M) Package: 3216; ASSY: USED; Status: Active; Power: *; Current: *; Part Ref: C1206_10uF_10%_25V_X5R; Comment_1: *; RoHs: True; Operating Temp: -55 to +125 C
C174 C179 C180 C183 C200 = C0402_0.0033uF_5%_25V_X7R: Capacitor ceramic, X7R, 0.0033uF, 25V, 5%, -55 to +85 C, EIA0402; Manufacturer 1: AVX; Mfg Part Number 1: 04023C332JAT2A; EIA(I) Package: 0402; EIA(M) Package: 1005; ASSY: USED; Status: Active; Power: *; Current: *; Part Ref: C0402_0.0033uF_5%_25V_X7R; Comment_1: *; RoHs: True; Operating Temp: -55 to +85 C
C243 C246 = C0603_1uF_10%_25V_X5R: Capacitor ceramic, X5R, 1uF, 25V, 10%, -55 to +85 C, EIA(M)1608; Manufacturer 1: TDK; Mfg Part Number 1: C1608X5R1E105K080AC; EIA(I) Package: 0603; EIA(M) Package: 1608; ASSY: USED; Status: Active; Power: *; Current: *; Part Ref: C0603_1uF_10%_25V_X5R; Comment_1: *; RoHs: True; Operating Temp: -55 to +85 C; Datasheet 1: ..\datasheet\Capacitor\TDK\C Series\2012-10-26
C244 = C0603_10uF_10%_10V_X5R: Capacitor ceramic, X5R, 10uF, 10V, 10%, -55 to +85 C, EIA0603; Manufacturer 1: TDK Corporation; Mfg Part Number 1: C1608X5R1A106K080AC; EIA(I) Package: 0603; EIA(M) Package: 1608; ASSY: USED; Status: Active; Power: *; Current: *; Part Ref: C0603_10uF_10%_10V_X5R; Comment_1: *; RoHs: True; Operating Temp: -55 to +85 C
C245 = C0201_0.1uF_10%_6.3V_X5R: as C184 on sheet QSPIFlash; Status: Active; Power: *; Current: *; Part Ref: C0201_0.1uF_10%_6.3V_X5R; Comment_1: *; RoHs: True; Operating Temp: -55 to +85 C
D3 = B330A-13-F: Diode, Schottky, Vz = 30V, -55 to 125C, SMT; Manufacturer 1: Diodes Inc; Current: 3A; ASSY: USED; Voltage: Vz= 30V; Status: Active; Power: *; EIA(I) Package: *; EIA(M) Package: *; Part Ref: B330A-13-F; Tolerance: *; Comment_1: *; RoHs: True; Value: B330A-13-F; Operating Temp: -55 to +125 C
D4 = LTST-C191TGKT: Led, Green, 150mcd, SMT, LTST-C191TGKT, -20 to +80 C, 0603; Manufacturer 1: LITE-ON; EIA(I) Package: 0603; ASSY: USED; Power: Pow; Current: 20mA; Voltage: 3.2V; Status: Active; EIA(M) Package: *; Part Ref: LTST-C191TGKT; Tolerance: *; Package: *; RoHs: True; Value: LTST-C191TGKT; Operating Temp: -20 to +80 C
L6 = SRN8040-2R2Y: Inductor, shielded, 13mOhm, 2.2uH, 6.3A, 30%, -40 to +105 C; Manufacturer 1: Bourns; ASSY: USED; Status: Active; Power: *; EIA(I) Package: *; EIA(M) Package: *; Part Ref: SRN8040-2R2Y; Voltage: *; Comment_1: *; RoHs: True; Tolerance: 30%; Operating Temp: -40 to +105 C
L7-L10 = SRN3015-1R0Y: Inductor, shielded, 48mOhm, 1uH, 2.35A, 30%, -40 to +125 C; Manufacturer 1: Bourns; ASSY: USED; Status: Active; Power: *; EIA(I) Package: *; EIA(M) Package: *; Part Ref: SRN3015-1R0Y; Voltage: *; Comment_1: *; RoHs: True; Tolerance: 30%; Operating Temp: -40 to +125 C
R46 = R0402_10k0_1%: as R65-R67 on sheet QSPIFlash; Status: Active; Part Ref: R0402_10k0_1%; Current: *; Comment_1: *; RoHs: True; Package: 0402; Operating Temp: -55 to +155 C; Datasheet 1: ..\datasheet\Resistor\Yaego\Thick_Film\RC0402\2012-03-29; Manufacturer 2: Vishay Dale; Mfg Part Number 2: CRCW040210k0FKED; Datasheet 2: ..\datasheet\Resistor\Vishay Dale\CRC\2012-03-29
R47 R52 R53 R60 R79 = R0402_1k00_1%: as R68 on sheet QSPIFlash; Status: Active; Part Ref: R0402_1k00_1%; Current: *; Comment_1: *; RoHs: True; Power: 1/16W; Operating Temp: -55 to +155 C; Datasheet 1: ..\datasheet\Resistor\Yaego\Thick_Film\RC0402\2012-03-29; Manufacturer 2: Vishay Dale; Mfg Part Number 2: CRCW04021k00FKED; Datasheet 2: ..\datasheet\Resistor\Vishay Dale\CRC\2012-03-29
R48 R49 R56 R57 R62 R80 R113 = R0402_4k99_1%: as R129 on sheet QSPIFlash; Status: Active; Part Ref: R0402_4k99_1%; Current: *; Comment_1: *; RoHs: True; Operating Temp: -50 to +155 C; Datasheet 1: ..\datasheet\Resistor\Yaego\Thick_Film\RC0402\2012-03-29; Manufacturer 2: Vishay Dale; Mfg Part Number 2: CRCW04024k99FKED; Datasheet 2: ..\datasheet\Resistor\Vishay Dale\CRC\2012-03-29
  R49 R56 R57 R62 R80: Power: 1/16W
  R113: Power: 1/16W; Tolerance: 1%
R50 = R0402_20k0_1%: as R125 on sheet QSPIFlash; Status: Active; Part Ref: R0402_20k0_1%; Current: *; Comment_1: *; RoHs: True; Operating Temp: -50 to +155 C; Datasheet 1: ..\datasheet\Resistor\Yaego\Thick_Film\RC0402\2012-03-29; Manufacturer 2: Vishay Dale; Mfg Part Number 2: CRCW040220k0FKED; Datasheet 2: ..\datasheet\Resistor\Vishay Dale\CRC\2012-03-29
R51 = R0402_240R_1%: Resistor, 240R, 1/16W, 1%, -50 to +155 C, EIA0402, EIA(M)1005; Manufacturer 1: Vishay Dale; Mfg Part Number 1: CRCW0402240RFKED; EIA(I) Package: 0402; EIA(M) Package: 1005; Voltage: 50V; ASSY: USED; Status: Active; Part Ref: R0402_240R_1%; Current: *; Comment_1: *; RoHs: True; Operating Temp: -50 to +155 C
R54 = R0402_13k0_1%: Resistor, 13k0, 1/16W, 1%, -50 to +155 C, EIA0402, EIA(M)1005; Manufacturer 1: Yageo; Mfg Part Number 1: RC0402FR-0713k0L; EIA(I) Package: 0402; EIA(M) Package: 1005; Voltage: 50V; ASSY: USED; Status: Active; Part Ref: R0402_13k0_1%; Current: *; Comment_1: *; RoHs: True; Operating Temp: -50 to +155 C; Datasheet 1: ..\datasheet\Resistor\Yaego\Thick_Film\RC0402\2012-03-29; Manufacturer 2: Vishay Dale; Mfg Part Number 2: CRCW040213k0FKED; Datasheet 2: ..\datasheet\Resistor\Vishay Dale\CRC\2012-03-29
R55 = R0402_56k2_1%: Resistor, 56k2, 1/16W, 1%, -50 to +155 C, EIA0402, EIA(M)1005; Manufacturer 1: Yageo; Mfg Part Number 1: RC0402FR-0756k2L; EIA(I) Package: 0402; EIA(M) Package: 1005; Voltage: 50V; ASSY: USED; Status: Active; Part Ref: R0402_56k2_1%; Current: *; Comment_1: *; RoHs: True; Operating Temp: -50 to +155 C; Datasheet 1: ..\datasheet\Resistor\Yaego\Thick_Film\RC0402\2012-03-29; Manufacturer 2: Vishay Dale; Mfg Part Number 2: CRCW040256k2FKED; Datasheet 2: ..\datasheet\Resistor\Vishay Dale\CRC\2012-03-29
R58 R63 = R0402_15k0_1%: Resistor, 15k0, 1/16W, 1%, -50 to +155 C, EIA0402, EIA(M)1005; Manufacturer 1: Yageo; Mfg Part Number 1: RC0402FR-0715k0L; EIA(I) Package: 0402; EIA(M) Package: 1005; Voltage: 50V; ASSY: USED; Status: Active; Part Ref: R0402_15k0_1%; Current: *; Comment_1: *; RoHs: True; Operating Temp: -50 to +155 C; Datasheet 1: ..\datasheet\Resistor\Yaego\Thick_Film\RC0402\2012-03-29; Manufacturer 2: Vishay Dale; Mfg Part Number 2: CRCW040215k0FKED; Datasheet 2: ..\datasheet\Resistor\Vishay Dale\CRC\2012-03-29
R59 = R0402_18k2_1%: Resistor, 18k2, 1/16W, 1%, -50 to +155 C, EIA0402, EIA(M)1005; Manufacturer 1: Yageo; Mfg Part Number 1: RC0402FR-0718k2L; EIA(I) Package: 0402; EIA(M) Package: 1005; Voltage: 50V; ASSY: USED; Status: Active; Part Ref: R0402_18k2_1%; Current: *; Comment_1: *; RoHs: True; Operating Temp: -50 to +155 C; Datasheet 1: ..\datasheet\Resistor\Yaego\Thick_Film\RC0402\2012-03-29; Manufacturer 2: Vishay Dale; Mfg Part Number 2: CRCW040218k2FKED; Datasheet 2: ..\datasheet\Resistor\Vishay Dale\CRC\2012-03-29
R61 = R0402_18k7_1%: Resistor, 18k7, 1/16W, 1%, -50 to +155 C, EIA0402, EIA(M)1005; Manufacturer 1: Yageo; Mfg Part Number 1: RC0402FR-0718k7L; EIA(I) Package: 0402; EIA(M) Package: 1005; Voltage: 50V; ASSY: USED; Status: Active; Part Ref: R0402_18k7_1%; Current: *; Comment_1: *; RoHs: True; Operating Temp: -50 to +155 C; Datasheet 1: ..\datasheet\Resistor\Yaego\Thick_Film\RC0402\2012-03-29; Manufacturer 2: Vishay Dale; Mfg Part Number 2: CRCW040218k7FKED; Datasheet 2: ..\datasheet\Resistor\Vishay Dale\CRC\2012-03-29
R81 = R0402_27k0_1%: Resistor, 27k0, 1/16W, 1%, -50 to +155 C, EIA0402, EIA(M)1005; Manufacturer 1: Yageo; Mfg Part Number 1: RC0402FR-0727kL; EIA(I) Package: 0402; EIA(M) Package: 1005; Voltage: 50V; ASSY: USED; Status: Active; Part Ref: R0402_27k0_1%; Current: *; Comment_1: *; RoHs: True; Operating Temp: -50 to +155 C; Datasheet 1: ..\datasheet\Resistor\Yaego\Thick_Film\RC0402\2012-03-29; Manufacturer 2: Vishay Dale; Mfg Part Number 2: CRCW040227k0FKED; Datasheet 2: ..\datasheet\Resistor\Vishay Dale\CRC\2012-03-29
R82 = R0402_5k10_1%: Resistor, 5k10, 1/16W, 1%, -50 to +155 C, EIA0402, EIA(M)1005; Manufacturer 1: Yageo; Mfg Part Number 1: RC0402FR-075k1L; EIA(I) Package: 0402; EIA(M) Package: 1005; Voltage: 50V; ASSY: USED; Status: Active; Part Ref: R0402_5k10_1%; Current: *; Comment_1: *; RoHs: True; Operating Temp: -50 to +155 C; Datasheet 1: ..\datasheet\Resistor\Yaego\Thick_Film\RC0402\2012-03-29; Manufacturer 2: Vishay Dale; Mfg Part Number 2: CRCW04025k10FKED; Datasheet 2: ..\datasheet\Resistor\Vishay Dale\CRC\2012-03-29
TP2-TP7 TP16 = 5000: Test point bead, red, Keystone Electronics, Thru-hole,; Manufacturer 1: Keystone inc; ASSY: USED; Power: Pow; Current: Cur; Voltage: Vol; Comment_1: Com; Status: Active; EIA(I) Package: *; EIA(M) Package: *; Part Ref: 5000; Tolerance: *; Package: *; RoHs: True; Mfg Part Number 1: 5000; Datasheet 1: ..\datasheet\Connector\Keystone Electronics\5001-5014\2012-06-28
U6 = TPS74012DGKT: Fixed 1.2V LDO Regulator with Dual Input Voltages, -40 to +85 C; Manufacturer 1: Texas Instruments; Current: 1.5A; PART NUMBER: TPS740XXDGK; Part Ref: TPS74012DGKT; Status: Active; RoHs: True; Value: TPS74012DGKT; Voltage: 1.2V; Operating Temp: -40 to +125 C
U7-U10 U14 = TLV62130RGT: Step-Down Converter with DCS-Control, 4-17V 3A, 16QFN; Manufacturer 1: Texas Instruments; Voltage: 4 to 17V; PART NUMBER: TLV62130RGT; Part Ref: TLV62130RGT; Status: Active; RoHs: True; Value: TLV62130RGT; Current: 3A; Operating Temp: -40 to +85 C; Mfg Part Number 1: TLV62130RGT

## Sheet BlockDiagram.SchDoc: 02290_Sonoma_Controller
size B; ApprovedBy: J Johnson; CheckedBy: J Johnson; Author: sdfasdfdfAEFfasdFfaF; DrawnBy: J Johnson; Organization: Opsero Electronic Design; Address1: 21-915 Av. Marguerite-Bourgeoys; Address2: Québec (QC); Address3: G1S 3X4; DocumentNumber: OP009-001-SCH; Revision: D-1; SheetNumber: 02; SheetTotal: 16; Tel1: (581) 308-8830; Tel2: (581) 308-8830; Project: 02290_Sonoma_Controller; CheckedDate: 2013-12-13; Sheet: Block diagram; PageSetup: Record=PageOptions|CenterHorizontal=True|CenterVertical=True|PrintScale=1.08|XCorrection=1.00|YCorrection=1.00|PrintKind=0|BorderSize=5000000|LeftOffset=0|BottomOffset=0|Orientation=2|PaperLength=1000|PaperWidth=1000|Scale=100|PaperSource=7|PrintQuality=-4|MediaType=1|DitherType=10|PaperKind=Tabloid     [11 x 17 in]|PrintScaleMode=1; DrawDate: 2013-12-13; SchTitle: 02290_Sonoma_Controller; RevDescription: Replaced Q2,Q3 with STD16NF06LT4; RevDate: 2020-07-07; RevBy: J Johnson; RevDescription2: Added resistors to QSPI interface; ModifiedDate: 2020-07-07
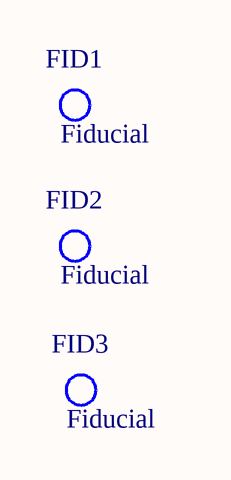
[diagram p15: BlockDiagram.SchDoc]

### Parts
FID1  FIDUCIAL  [FIDUCIAL15-30-TB]  (no BOM)
FID2  FIDUCIAL  [FIDUCIAL15-30-TB]  (no BOM)
FID3  FIDUCIAL  [FIDUCIAL15-30-TB]  (no BOM)

### Notes on the sheet
- REV.
- DESCRIPTION
- DATE
- APPROVED
- Incal Inc.
- SHEET
- TITLE
- CONFIG.
- PROJECT
- SIZE
- SCH P/N.
- DRAWN
- B
- OF

### Library data of the parts
FID1-FID3 = FIDU_15_30_TB: Fiducial, 1.5mm, 3.0mm ring; Manufacturer 1: Opsero; Status: Active; EIA(I) Package: *; EIA(M) Package: *; Tolerance: *; Package: *; RoHs: True; Part Ref: FIDU_15_30_TB; Datasheet 1: http://opsero.com; Mfg Part Number 1: FIDUCIAL; Value: Fiducial